# EAGLE design sh (EAGLE 9.6.2)
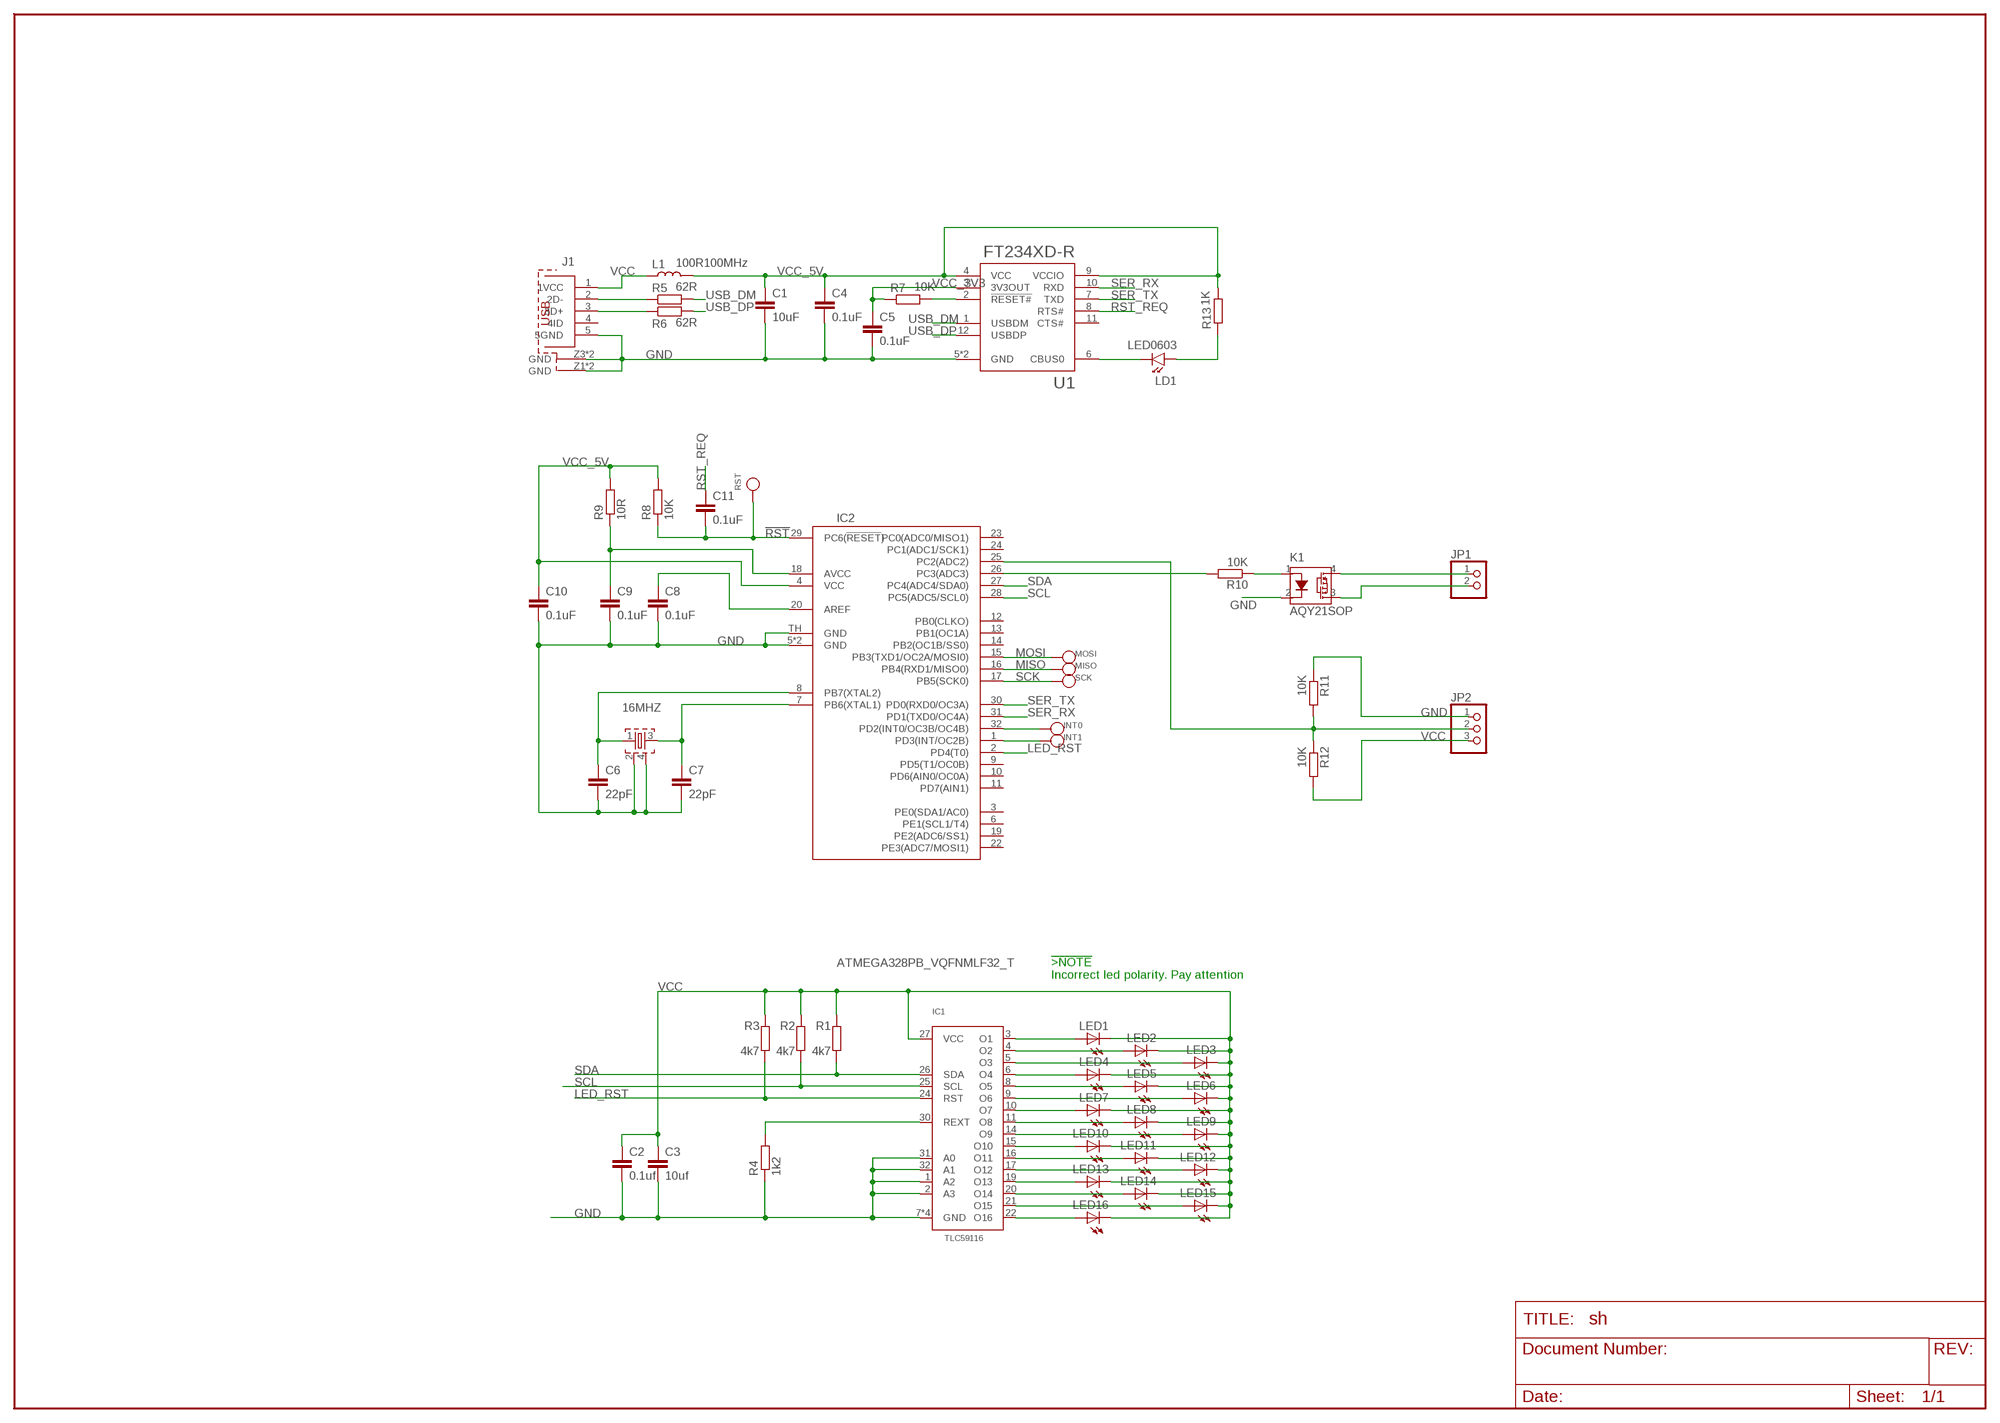
[diagram p0: schematic, sheet 1]

## Parts
16MHZ  QUARTZ_ZQ  [QUARTZ_3X3MM]
C1  10uF  SMD_C1206  [1206]
C2  0.1uf  SMD_C0603  [0603]
C3  10uf  SMD_C1206  [1206]
C4  0.1uF  SMD_C0603  [0603]
C5  0.1uF  SMD_C0603  [0603]
C6  22pF  SMD_C0603  [0603]
C7  22pF  SMD_C0603  [0603]
C8  0.1uF  SMD_C0603  [0603]
C9  0.1uF  SMD_C0603  [0603]
C10  0.1uF  SMD_C0603  [0603]
C11  0.1uF  SMD_C0603  [0603]
IC1  TLC59116  [MLF32-TH]
IC2  ATMEGA328PB_VQFNMLF32_T  [MLF32-TH]
INT0  TEST_POINT_D2MM  [TP]
INT1  TEST_POINT_D2MM  [TP]
J1  MINI_USB_TYP_B_@  [65100516121]
JP1  PINHD-1X2LIGHT  [2X01]
JP2  PINHD-1X3_LIGHT  [3X01]
K1  AQY21SOP  [SOP04]
L1  100R100MHz  SMD_L  [0805]
LD1  LED0603  [0603_P]
LED1  LED2KA-3528ASYC  [KA-3528ASYC]
LED2  LED2KA-3528ASYC  [KA-3528ASYC]
LED3  LED2KA-3528ASYC  [KA-3528ASYC]
LED4  LED2KA-3528ASYC  [KA-3528ASYC]
LED5  LED2KA-3528ASYC  [KA-3528ASYC]
LED6  LED2KA-3528ASYC  [KA-3528ASYC]
LED7  LED2KA-3528ASYC  [KA-3528ASYC]
LED8  LED2KA-3528ASYC  [KA-3528ASYC]
LED9  LED2KA-3528ASYC  [KA-3528ASYC]
LED10  LED2KA-3528ASYC  [KA-3528ASYC]
LED11  LED2KA-3528ASYC  [KA-3528ASYC]
LED12  LED2KA-3528ASYC  [KA-3528ASYC]
LED13  LED2KA-3528ASYC  [KA-3528ASYC]
LED14  LED2KA-3528ASYC  [KA-3528ASYC]
LED15  LED2KA-3528ASYC  [KA-3528ASYC]
LED16  LED2KA-3528ASYC  [KA-3528ASYC]
MISO  TEST_POINT_D2MM  [TP]
MOSI  TEST_POINT_D2MM  [TP]
R1  4k7  SMD_R0603  [0603]
R2  4k7  SMD_R0603  [0603]
R3  4k7  SMD_R0603  [0603]
R4  1k2  SMD_R0603  [0603]
R5  62R  SMD_R0603  [0603]
R6  62R  SMD_R0603  [0603]
R7  10K  SMD_R0603  [0603]
R8  10K  SMD_R0603  [0603]
R9  10R  SMD_R0603  [0603]
R10  10K  SMD_R0603  [0603]
R11  10K  SMD_R0603  [0603]
R12  10K  SMD_R0603  [0603]
R13  1K  SMD_R0603  [0603]
RST  TEST_POINT_D2MM  [TP]
SCK  TEST_POINT_D2MM  [TP]
U1  FT234XD-R  [IC_FT234XD-R]

## Nets
!RST: C11.2 IC2.29(PC6(!RESET!)) R8.1 RST.P$1
GND: 16MHZ.2 16MHZ.4 C1.2 C2.2 C3.2 C4.2 C5.2 C6.2 C7.2 C8.2 C9.2 C10.2 IC1.1(A2) IC1.2(A3) IC1.7(GND) IC1.18(GND) IC1.23(GND) IC1.31(A0) IC1.32(A1) IC1.TH(GND) IC2.5(GND) IC2.21(GND) IC2.TH(GND) J1.5(5GND) J1.Z1(GND) J1.Z2(GND) J1.Z3(GND) J1.Z4(GND) JP2.1 K1.2(K) R4.1 R11.1 U1.5(GND) U1.13(GND)
LED_RST: IC1.24(RST) IC2.2(PD4(T0)) R3.1
MISO: IC2.16(PB4(RXD1/MISO0)) MISO.P$1
MOSI: IC2.15(PB3(TXD1/OC2A/MOSI0)) MOSI.P$1
N$1: IC1.3(O1) LED1.A
N$2: IC1.4(O2) LED2.A
N$3: IC1.5(O3) LED3.A
N$4: IC1.6(O4) LED4.A
N$5: IC1.8(O5) LED5.A
N$6: IC1.9(O6) LED6.A
N$7: IC1.10(O7) LED7.A
N$8: IC1.11(O8) LED8.A
N$9: IC1.14(O9) LED9.A
N$10: IC1.15(O10) LED10.A
N$11: IC1.16(O11) LED11.A
N$12: IC1.17(O12) LED12.A
N$13: IC1.19(O13) LED13.A
N$14: IC1.20(O14) LED14.A
N$15: IC1.21(O15) LED15.A
N$16: IC1.22(O16) LED16.A
N$17: IC2.26(PC3(ADC3)) R10.2
N$18: 16MHZ.1 C6.1 IC2.8(PB7(XTAL2))
N$19: J1.2(2D-) R5.1
N$20: IC2.32(PD2(INT0/OC3B/OC4B)) INT0.P$1
N$21: J1.3(3D+) R6.1
N$22: IC1.30(REXT) R4.2
N$23: 16MHZ.3 C7.1 IC2.7(PB6(XTAL1))
N$24: R7.2 U1.2(!RESET#)
N$25: C8.1 IC2.20(AREF)
N$26: C9.1 IC2.18(AVCC) R9.1
N$27: JP1.1 K1.4(DS1)
N$29: K1.1(A) R10.1
N$30: JP1.2 K1.3(DS2)
N$31: LD1.1(K) U1.6(CBUS0)
N$32: LD1.2(A) R13.1
N$33: IC2.25(PC2(ADC2)) JP2.2 R11.2 R12.1
N$34: IC2.1(PD3(INT/OC2B)) INT1.P$1
RST_REQ: C11.1 U1.8(RTS#)
SCK: IC2.17(PB5(SCK0)) SCK.P$1
SCL: IC1.25(SCL) IC2.28(PC5(ADC5/SCL0)) R2.1
SDA: IC1.26(SDA) IC2.27(PC4(ADC4/SDA0)) R1.1
SER_RX: IC2.31(PD1(TXD0/OC4A)) U1.10(RXD)
SER_TX: IC2.30(PD0(RXD0/OC3A)) U1.7(TXD)
USB_DM: R5.2 U1.1(USBDM)
USB_DP: R6.2 U1.12(USBDP)
VCC: C2.1 C3.1 IC1.27(VCC) J1.1(1VCC) JP2.3 L1.1 LED1.C LED2.C LED3.C LED4.C LED5.C LED6.C LED7.C LED8.C LED9.C LED10.C LED11.C LED12.C LED13.C LED14.C LED15.C LED16.C R1.2 R2.2 R3.2 R12.2
VCC_3V3: C5.1 R7.1 U1.3(3V3OUT)
VCC_5V: C1.1 C4.1 C10.1 IC2.4(VCC) L1.2 R8.2 R9.2 R13.2 U1.4(VCC) U1.9(VCCIO)
Unconnected: IC2.3(PE0(SDA1/AC0)) IC2.6(PE1(SCL1/T4)) IC2.9(PD5(T1/OC0B)) IC2.10(PD6(AIN0/OC0A)) IC2.11(PD7(AIN1)) IC2.12(PB0(CLKO)) IC2.13(PB1(OC1A)) IC2.14(PB2(OC1B/SS0)) IC2.19(PE2(ADC6/SS1)) IC2.22(PE3(ADC7/MOSI1)) IC2.23(PC0(ADC0/MISO1)) IC2.24(PC1(ADC1/SCK1)) J1.4(4ID) U1.11(CTS#)

## Notes on the sheet
- !>NOTE
  Incorrect led polarity. Pay attention

## Library data of the parts
16MHZ = passive_components:QUARTZ_ZQ
C1-C11 = passive_components:SMD_C
IC1 = my_IC:TLC59116
IC2 = my_IC:ATMEGA328PB_VQFN
INT0 INT1 MISO MOSI RST SCK = passive_components:TEST_POINT_D2MM
J1 = passive_components:MINI_USB_TYP_B_@
JP1 = pinhead:PINHD-1X2: PIN HEADER
JP2 = pinhead:PINHD-1X3: PIN HEADER
K1 = relays:AQY*: PhotoMOS Relay NAiS Source: http://www.panasonic-electric-works.com/catalogues/downloads/photomos/ds_x615_en_aqz10_20.pdf; OC_FARNELL: unknown; OC_NEWARK: unknown
L1 = passive_components:SMD_L
LD1 = passive_components:LED
LED1-LED16 = rcl:LED2: LED OSRAM: - CHIPLED LG R971, LG N971, LY N971, LG Q971, LY Q971, LO R971, LY R971 LH N974, LH R974 LS Q976, LO Q976, LY Q976 LO Q996 - Hyper CHIPLED LW Q18S LB Q993, LB Q99A, LB R99A - SideLED LS A670, LO A670, LY A670, LG A670, LP A670 LB A673, LV A673, LT A673, LW A673 LH A674 LY A675 LS A676, LA A676, LO A676, LY A676, LW A676 LS A679, LY A679, LG A679 - Hyper Micro SIDELED® LS Y876, LA Y876, LO Y876, LY Y876 LT Y87S - SmartLED LW L88C, LW L88S LB L89C, LB L89S, LG L890 LS L89K, LO L89K, LY L89K LS L896, LA L896, LO L896, LY L896 - TOPLED LS T670, LO T670, LY T670, LG T670, LP T670 LSG T670, LSP T670, LSY T670, LOP T670, LYG T670 LG T671, LOG T671, LSG T671 LB T673, LV T673, LT T673, LW T673 LH T674 LS T676, LA T676, LO T676, LY T676, LB T676, LH T676, LSB T676, LW T676 LB T67C, LV T67C, LT T67C, LS T67K, LO T67K, LY T67K, LW E67C LS E67B, LA E67B, LO E67B, LY E67B, LB E67C, LV E67C, LT E67C LW T67C LS T679, LY T679, LG T679 LS T770, LO T770, LY T770, LG T770, LP T770 LB T773, LV T773, LT T773, LW T773 LH T774 LS E675, LA E675, LY E675, LS T675 LS T776, LA T776, LO T776, LY T776, LB T776 LHGB T686 LT T68C, LB T68C - Hyper Mini TOPLED® LB M676 - Mini TOPLED Santana® LG M470 LS M47K, LO M47K, LY M47K Source: http://www.osram.convergy.de LUXEON: - LUMILED® LXK2-PW12-R00, LXK2-PW12-S00, LXK2-PW14-U00, LXK2-PW14-V00 LXK2-PM12-R00, LXK2-PM12-S00, LXK2-PM14-U00 LXK2-PE12-Q00, LXK2-PE12-R00, LXK2-PE12-S00, LXK2-PE14-T00, LXK2-PE14-U00 LXK2-PB12-K00, LXK2-PB12-L00, LXK2-PB12-M00, LXK2-PB14-N00, LXK2-PB14-P00, LXK2-PB14-Q00 LXK2-PR12-L00, LXK2-PR12-M00, LXK2-PR14-Q00, LXK2-PR14-R00 LXK2-PD12-Q00, LXK2-PD12-R00, LXK2-PD12-S00 LXK2-PH12-R00, LXK2-PH12-S00 LXK2-PL12-P00, LXK2-PL12-Q00, LXK2-PL12-R00 Source: www.luxeon.com KINGBRIGHT: KA-3528ASYC Source: www.kingbright.com
R1-R13 = passive_components:SMD_R
U1 = my_IC:FT234XD-R: USB Bridge, USB to UART USB 2.0 UART Interface 12-DFN (3x3); AVAILABILITY: Unavailable; DESCRIPTION: USB Bridge, USB to UART USB 2.0 UART Interface 12-DFN (3x3); MF: FTDI,; MP: FT234XD-R; PACKAGE: DFN-12 FTDI; PRICE: None

## Board
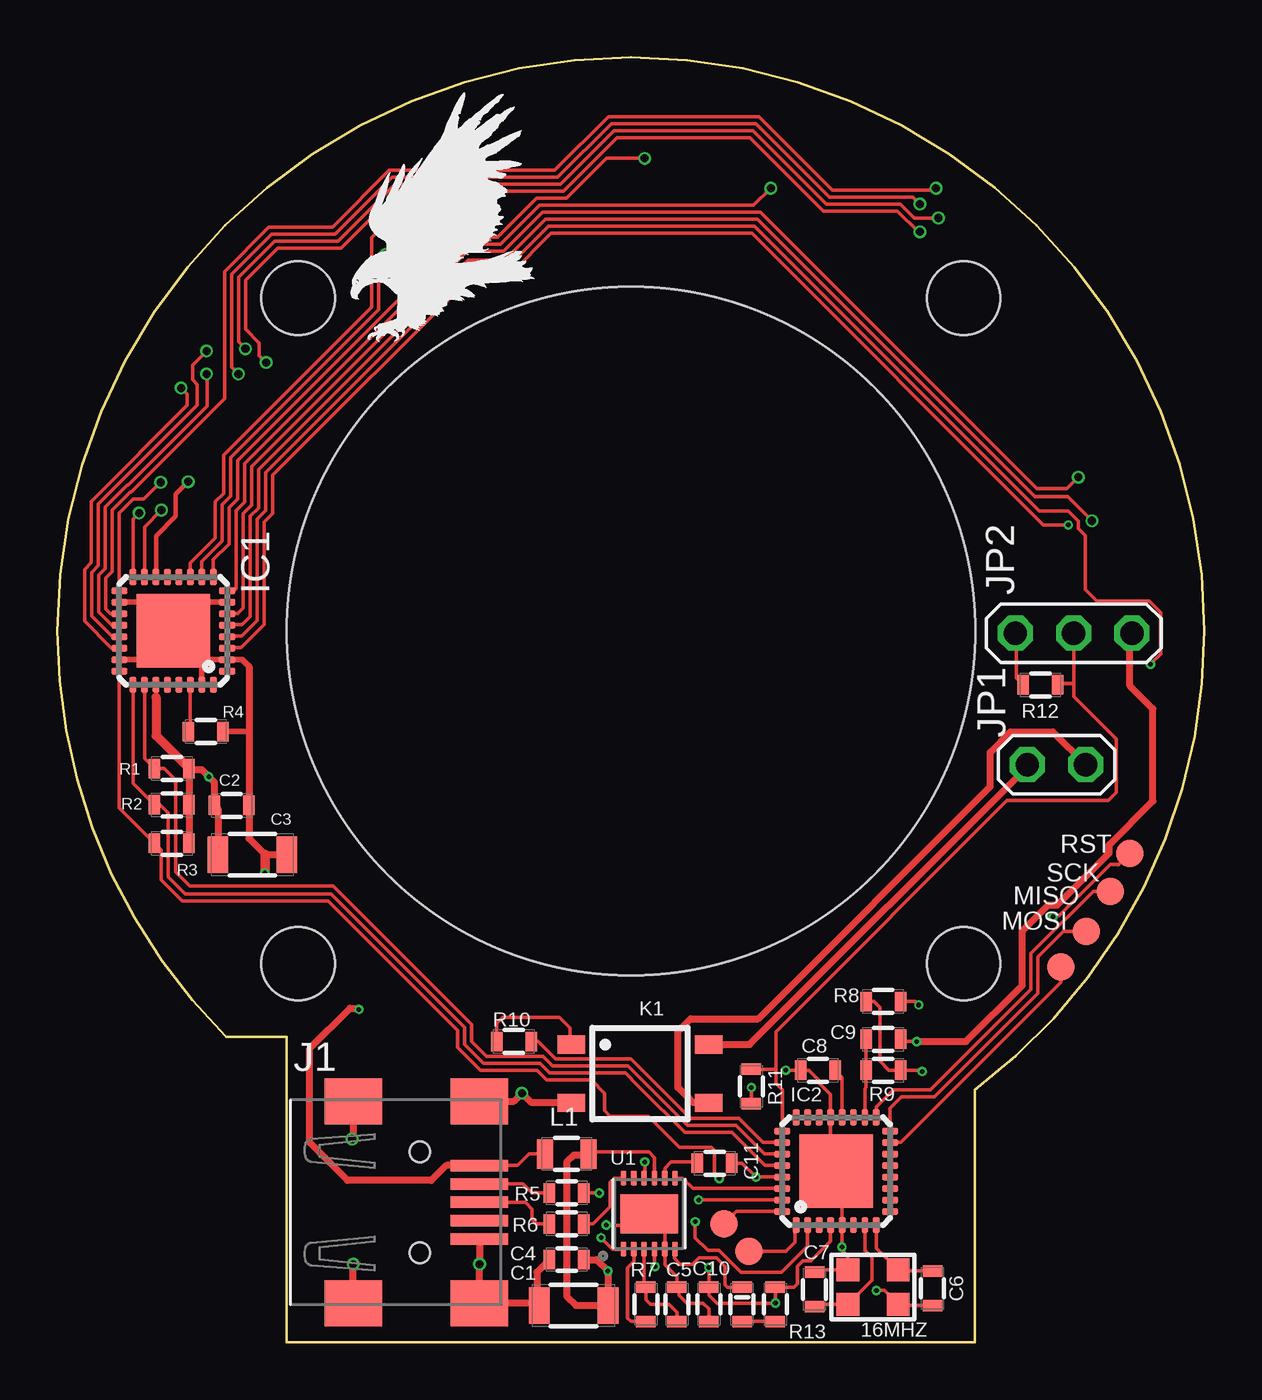
[diagram p1: board, top side]
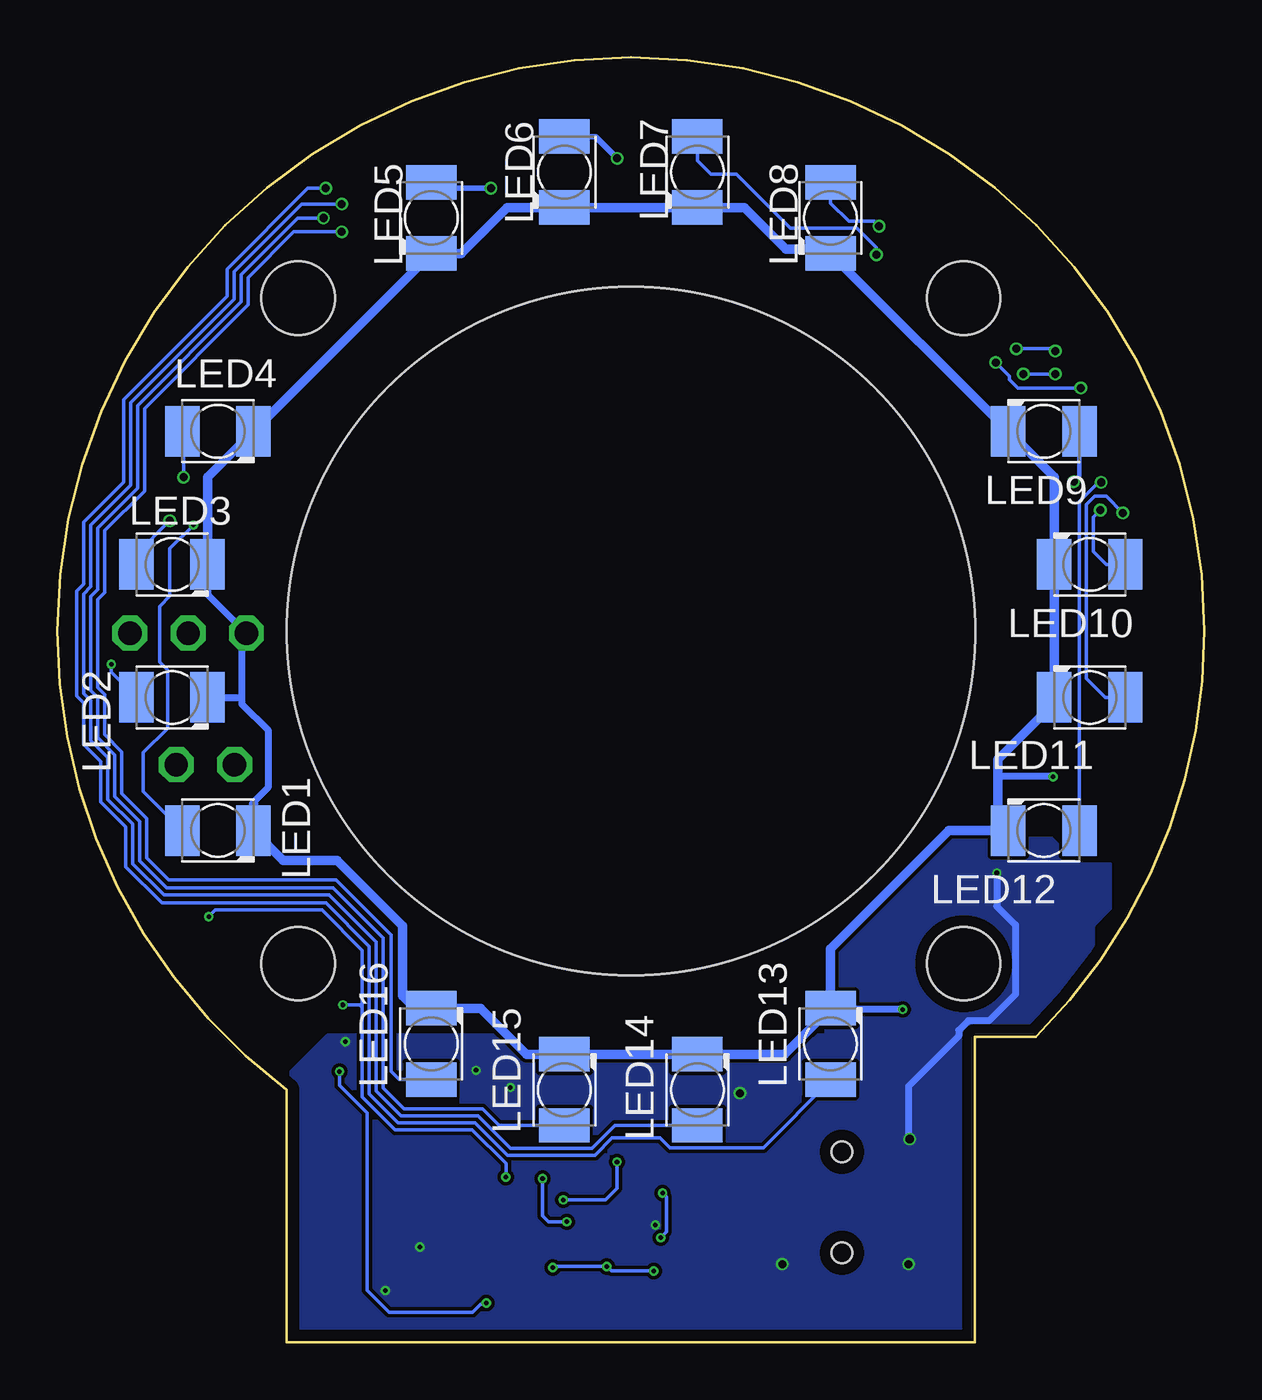
[diagram p2: board, bottom side, seen from below]

Size 50 x 56 mm. Coordinates in mm from the lower left corner, seen from the top.
Outline: 10,0 40,0 40,11 arc53 50,31 arc180 0,31 arc45 7.35,13.3 10,13.3 10,0
Copper layers (1*16): Top 0.035mm / dielectric 1.5mm / Bottom 0.035mm
Design rules "default *": minimum track width 6mil, minimum drill 0.2mm, track to track 6mil, track to pad 6mil, pad to pad 6mil, via to via 6mil, smd to smd 6mil, copper to edge 20mil, drill to drill 6mil, minimum pad ring 10mil, minimum via ring 4mil, stop-mask expansion 4mil, vias tented up to drill 20mil, thermal gap 10mil
Holes 3.2 mm at 10.5,45.5 39.5,45.5 39.5,16.5 10.5,16.5
Holes 30 mm at 25,31

### Footprints (pad centres in the part's own frame; a part is rotated, then mirrored left to right if it is on the bottom)
QUARTZ_3X3MM = smd 1 x 1: 1 -0.75,1.1; 2 0.75,1.1; 3 0.75,-1.1; 4 -0.75,-1.1
1206 = smd 1.6 x 0.9: 1 0,1.5; 2 0,-1.5
0603 = smd 0.85 x 0.5: 1 0,0.75; 2 0,-0.75
MLF32-TH = smd 0.7 x 0.3: 1 -2.35,1.75; 2 -2.35,1.25; 3 -2.35,0.75; 4 -2.35,0.25; 5 -2.35,-0.25; 6 -2.35,-0.75; 7 -2.35,-1.25; 8 -2.35,-1.75; 17 2.35,-1.75; 18 2.35,-1.25; 19 2.35,-0.75; 20 2.35,-0.25; 21 2.35,0.25; 22 2.35,0.75; 23 2.35,1.25; 24 2.35,1.75 | smd 0.3 x 0.7: 9 -1.75,-2.35; 10 -1.25,-2.35; 11 -0.75,-2.35; 12 -0.25,-2.35; 13 0.25,-2.35; 14 0.75,-2.35; 15 1.25,-2.35; 16 1.75,-2.35; 25 1.75,2.35; 26 1.25,2.35; 27 0.75,2.35; 28 0.25,2.35; 29 -0.25,2.35; 30 -0.75,2.35; 31 -1.25,2.35; 32 -1.75,2.35 | smd 3.2 x 3.2: TH 0,0
TP = smd 1.2 x 1.2: P$1 0,0
65100516121 = smd 0.5 x 2.5: 1 -1.6,2.6; 2 -0.8,2.6; 3 0,2.6; 4 0.8,2.6; 5 1.6,2.6 | smd 2 x 2.5: Z1 -4.4,2.6; Z2 4.4,2.6; Z3 4.4,-2.9; Z4 -4.4,-2.9 | hole 0.9: -2.2,0; 2.2,0
2X01 = drill 1.016 octagon: 1 -1.27,-1.27; 2 -1.27,1.27
3X01 = drill 1.016 octagon: 1 0,-2.54; 2 0,0; 3 0,2.54
SOP04 = smd 0.8 x 1.2: 1 -1.27,-3; 2 1.27,-3; 3 1.27,3; 4 -1.27,3
0805 = smd 1.3 x 0.7: 1 0,0.95; 2 0,-0.95
0603_P = smd 0.85 x 0.5: 1 0,0.75; 2 0,-0.75
KA-3528ASYC = smd 1.5 x 2.2: A -1.55,0; C 1.55,0
IC_FT234XD-R = smd 0.65 x 0.25: 1 -1.55,1.125; 2 -1.55,0.675; 3 -1.55,0.225; 4 -1.55,-0.225; 5 -1.55,-0.675; 6 -1.55,-1.125; 7 1.55,-1.125; 8 1.55,-0.675; 9 1.55,-0.225; 10 1.55,0.225; 11 1.55,0.675; 12 1.55,1.125 | smd 1.7 x 2.5: 13 0,0

### Placement (x,y rotation side)
16MHZ  35.55,2.4 270 top
C1  22.5,1.6 270 top
C2  7.6,23.4 90 top
C3  8.5,21.25 90 top
C4  22.2,3.6 270 top
C5  27,1.65 180 top
C6  38.15,2.35 0 top
C7  33,2.3 180 top
C8  33.15,11.85 270 top
C9  36,13.2 90 top
C10  28.4,1.65 0 top
C11  28.65,7.8 90 top
IC1  5.05,31 180 top
IC2  33.95,7.45 90 top
INT0  29.05,5.15 0 top
INT1  30.15,3.95 0 top
J1  15.8,6.1 270 top
JP1  43.55,23.9 270 top
JP2  44.3,30.9 90 top
K1  25.4,11.7 270 top
L1  22.2,8.2 90 top
LD1  29.85,1.65 0 top
LED1  43,22.3 0 bottom
LED2  45,28.1 0 bottom
LED3  45,33.9 0 bottom
LED4  43,39.7 0 bottom
LED5  33.7,49 270 bottom
LED6  27.9,51 270 bottom
LED7  22.1,51 270 bottom
LED8  16.3,49 270 bottom
LED9  7,39.7 180 bottom
LED10  5,33.9 180 bottom
LED11  5,28.1 180 bottom
LED12  7,22.3 180 bottom
LED13  16.3,13 90 bottom
LED14  22.1,11 90 bottom
LED15  27.9,11 90 bottom
LED16  33.7,13 90 bottom
MISO  44.85,17.9 0 top
MOSI  43.75,16.35 0 top
R1  4.99,25 90 top
R2  4.99,23.42 90 top
R3  4.99,21.74 90 top
R4  6.47,26.61 270 top
R5  22.2,6.5 90 top
R6  22.2,5.15 90 top
R7  25.65,1.65 0 top
R8  36,14.85 270 top
R9  36,11.85 90 top
R10  19.9,13.1 90 top
R11  30.25,11.15 180 top
R12  42.85,28.65 270 top
R13  31.3,1.65 180 top
RST  46.75,21.3 0 top
SCK  45.9,19.65 0 top
U1  25.8,5.6 90 top
U$1  [EAGLE-PLC-8MM]  12.8,43.6 0 top

### Tracks (layer width: path | path; a pad name or v marks a point on that pad's centre or on a via)
!RST  (via drill 0.2)
  Top 0.152: 46.25,20.8 46.27,20.82 | 46.27,20.82 RST.P$1 | IC2.29 v30.45,7.2 29.85,7.8 C11.2 | v43.4,18.55 43.4,18.6 43.67,18.6 45.89,20.82 46.27,20.82 | R8.1 37.4,14.85 v37.55,14.7
  Bottom 0.152: v30.45,7.2 30.45,7.79 31.92,9.26 35.27,9.26 36.71,10.7 36.71,14.6 | 36.71,14.6 36.71,17.08 38.46,18.83 43.12,18.83 v43.4,18.55 | v37.55,14.7 36.81,14.7 36.71,14.6
GND  (via drill 0.2, 0.35)
  Top 0.152: 5.05,30.95 IC1.TH | IC1.31 IC1.32 | IC1.1 IC1.2 | v23.93,5.1 25.3,5.1 U1.13 25.8,5.55 26.48,4.88 U1.5 26.48,3.48 26.48,3.37 27,2.85 C5.2 27,2.35 27.1,2.25 27.1,2.05 27.45,1.7 28.15,1.7 28.4,1.45 C10.2 | C7.2 33.1,3.15 16MHZ.4 34.45,3.75 34.2,4 v34.2,4.15 IC2.5 34.2,7.2 IC2.TH 33.7,7.7 IC2.21 33.7,10.8 33.2,11.3 33.2,11.4 32.75,11.85 C8.2 v31.75,11.85 | C6.2 36.7,1.6 16MHZ.2 36.05,2.25 v35.7,2.25 | C9.2 36.85,13.1 v37.45,13.1 | R11.1 v30.25,11.1
  Top 0.25: IC1.18 4,32.25 5.05,31.2 5.05,31.05 | 5.05,31.05 IC1.TH | IC1.7 6.4,32.25 6.35,32.3 6.3,32.3 5.1,31.1 | 5.1,31.1 5.05,31.05 | 5.05,30.95 3.85,29.75 IC1.23 | 6.3,29.75 IC1.2 8.05,29.75 8.35,29.45 | 6.3,29.75 5.85,29.75 5.1,30.5 5.1,31.1 | IC1.31 6.3,29.75 | R4.1 8.29,26.61 8.35,26.55
  Top 0.305: C3.2 9.05,21.25 8.35,21.95 C2.2 8.35,26.55 8.35,29.45 | J1.5 v18.4,3.4 J1.Z2 20.9,1.7 | 20.9,1.7 C1.2 | C4.2 20.9,3.05 20.9,1.7 | J1.Z4 12.9,8.9 v12.85,8.85 | J1.Z1 19.9,10.5 v20.25,10.85 20.67,10.43 K1.2 | J1.Z3 v12.9,3.4 | v37.45,13.1 39.61,13.1 42.05,15.54 42.05,17.92 43.19,19.06 43.59,19.06 45.84,21.32 45.84,21.68 47.75,23.58 47.75,27.6 46.75,28.6 46.75,30.81 JP2.1
  Top 0.406: 9.05,21.25 v9.05,20.45
  Bottom 0.152: v34.2,4.15 34.25,4.15
  Bottom 0.305: v12.85,8.85 12.9,8.9 12.9,11.15 10.71,13.34 10.71,13.6 10.29,14.01 9.39,14.01 8.24,15.16 8.24,18.19 9.05,19 v9.05,20.45
  pour Bottom: 10.15,13.3 38.2,13.3 39.8,11.7 39.8,0.2 10.2,0.2 10.2,13.25
  pour Bottom: 10.7,13.4 10.5,13.6 7.4,13.6 6.15,14.85 6.15,15.3 4.85,16.6 4.85,18.15 4.1,18.9 4.1,20.85 5.55,20.85 6.65,21.95 10.9,21.95 16.5,16.35 16.5,13.4
LED_RST  (via drill 0.2)
  Top 0.152: IC1.24 2.7,23.28 R3.1 4.53,21.45 4.53,20.15 5.45,19.23 11.81,19.23 17.44,13.6 17.44,12.85 18.45,11.84 20.92,11.84 21.33,11.43 23.27,11.43 23.85,10.85 23.85,10.1 24.1,9.85 25.77,9.85 27.12,8.49 | 27.12,8.49 27.13,8.48 | 27.12,8.49 28.5,8.49 28.65,8.35 28.65,7.3 28.82,7.13 v28.85,7.13 | IC2.2 32.7,4.18 31.55,3.04 29.95,3.04 29.85,3.04 29.8,3.04 28.83,4 28.35,4 27.8,4.55 v27.8,5.25
  Bottom 0.152: v28.85,7.13 28.85,5.5 28.6,5.25 v27.8,5.25
MISO
  Top 0.152: IC2.16 36.3,10.2 36.8,10.7 38.23,10.7 42.74,15.21 42.74,16.79 43.85,17.9 MISO.P$1
MOSI
  Top 0.152: IC2.15 36.76,8.7 43.75,15.69 MOSI.P$1
N$1  (via drill 0.2)
  Top 0.152: IC1.3 7.42,30.27 8,30.27 9.01,31.29 9.01,35.74 9.38,36.11 9.38,37.78 18.16,46.56 19.75,46.56 21.53,48.33 30.27,48.33 42.98,35.62 v44.07,35.62
  Bottom 0.152: LED1.A 46.25,24 46.25,25.7 45.2,26.75 45.2,29.3 45.55,29.65 45.55,32.07 45.09,32.52 45.09,34.59 v44.07,35.62
N$2  (via drill 0.2)
  Top 0.152: IC1.4 7.42,30.77 8.03,30.77 8.71,31.45 8.71,35.87 9.08,36.24 9.08,37.91 18.03,46.86 19.63,46.86 21.4,48.64 30.39,48.64 42.81,36.22 44.07,36.22 44.5,35.8 44.5,35.45 44.8,35.15 44.8,32.8 45.3,32.3 47.6,32.3 48.1,31.8 48.1,30 v47.65,29.55
  Bottom 0.152: v47.65,29.55 47.65,29.2 LED2.A
N$3  (via drill 0.35)
  Top 0.152: IC1.5 7.42,31.27 8.05,31.27 8.4,31.62 8.4,36 8.77,36.37 8.77,38.03 17.91,47.17 19.5,47.17 21.27,48.94 30.52,48.94 42.61,36.85 44.05,36.85 v45.1,35.8
  Bottom 0.152: v45.1,35.8 46.55,34.35 LED3.A
N$4  (via drill 0.35)
  Top 0.152: IC1.6 7.85,31.75 8.1,32 8.1,36.12 8.47,36.49 8.47,38.16 17.85,47.54 19.3,47.55 19.45,47.55 21.15,49.25 30.65,49.25 42.69,37.2 44,37.2 v44.5,37.7
  Bottom 0.152: v44.5,37.7 44.5,39.65 LED4.A
N$5  (via drill 0.35 pad 0.5)
  Top 0.152: IC1.8 7.7,32.75 7.79,32.84 7.79,36.25 8.16,36.62 8.16,38.3 17.72,47.85 19.32,47.85 21.02,49.55 30.35,49.55 v31.1,50.3
  Bottom 0.25: v31.1,50.3 33.45,50.3 LED5.A
N$6  (via drill 0.35 pad 0.5)
  Top 0.152: IC1.9 6.8,34.1 7.49,34.79 7.49,36.38 7.86,36.74 7.86,38.42 17.59,48.16 19.19,48.16 20.89,49.86 22.2,49.86 23.94,51.6 v25.6,51.6
  Bottom 0.25: v25.6,51.6 26.55,52.55 LED6.A
N$7  (via drill 0.35)
  Top 0.152: IC1.10 6.3,34.03 7.19,34.92 7.19,36.5 7.55,36.87 7.55,38.55 14,44.99 14,47.1 v14.3,47.4
  Bottom 0.152: LED7.A 22.1,51.5 21.5,50.9 20.4,50.9 18.05,48.55 15.15,48.55 14.3,47.7 v14.3,47.4
N$8  (via drill 0.35)
  Top 0.152: IC1.11 5.8,33.96 6.88,35.04 6.88,36.63 7.25,37 7.25,38.67 13.69,45.12 13.69,48.15 v14.18,48.64
  Bottom 0.152: LED8.A 16.3,49.65 15.51,48.85 14.4,48.85 v14.18,48.64
N$9  (via drill 0.35)
  Top 0.2: v5.7,37.5 5.17,36.97 5.17,36 4.3,35.13 IC1.14
  Bottom 0.2: v5.7,37.5 5.45,37.75 LED9.A
  Bottom 0.25: LED9.A 5.5,39.65
N$10  (via drill 0.35)
  Top 0.152: IC1.15 3.8,35.53 v4.54,36.26
  Bottom 0.152: v4.54,36.26 4.84,35.96 4.84,34.46 4.27,33.9 LED10.A
N$11  (via drill 0.35)
  Top 0.152: IC1.16 3.3,35.88 v3.56,36.14
  Bottom 0.152: v3.56,36.14 4.29,36.87 4.79,36.87 5.14,36.52 5.14,28.92 4.32,28.1 LED11.A
N$12  (via drill 0.35)
  Top 0.152: v4.5,37.48 3.77,36.75 3.31,36.75 2.7,36.14 IC1.17
  Bottom 0.152: v4.5,37.48 4.61,37.48 5.45,36.64 5.45,26.55 LED12.A
N$13  (via drill 0.35)
  Top 0.152: v38.3,50.3 38.21,50.21 33.78,50.21 30.58,53.41 24.02,53.41 21.68,51.08 14.47,51.08 11.99,48.6 9.22,48.6 7.29,46.67 7.29,41.12 3.22,37.05 3.18,37.05 2.4,36.27 2.4,33.59 2.1,33.3 2.1,31.95 2.3,31.75 IC1.19
  Bottom 0.152: LED13.A 16.3,11.4 19.23,8.47 23.3,8.47 23.72,8.9 25.82,8.9 26.57,8.14 30.38,8.14 31.79,9.56 35.15,9.56 36.41,10.82 36.41,17.26 38.29,19.14 45.43,19.14 47.01,20.72 47.01,22.45 48.1,23.54 48.1,25.3 48.85,26.05 48.85,27.85 49.16,28.16 49.16,32.74 48.85,33.05 48.85,35.74 47.11,37.48 47.11,41.08 42.6,45.59 42.6,46.78 39.08,50.3 v38.3,50.3
N$14  (via drill 0.35)
  Top 0.152: v37.6,49.61 37.3,49.91 33.65,49.91 30.45,53.11 24.15,53.11 21.81,50.77 14.59,50.77 12.12,48.29 9.34,48.29 7.59,46.54 7.59,42.5 v7.89,42.2 | IC1.20 2.68,31.27 2.35,31.27 1.79,31.82 1.79,33.43 2.09,33.72 2.09,36.4 3.05,37.36 3.09,37.36 6.53,40.8 6.53,42.17 v6.5,42.2
  Bottom 0.152: LED14.A 25.7,9.45 26.7,8.45 30.25,8.45 31.67,9.87 35.02,9.87 36.1,10.95 36.1,17.44 38.15,19.49 45.35,19.49 46.71,20.85 46.71,22.58 47.8,23.66 47.8,25.48 48.55,26.23 48.55,27.98 48.85,28.28 48.85,28.32 48.85,32.62 48.55,32.92 48.55,35.62 46.81,37.35 46.81,40.95 42.3,45.46 42.3,46.65 39.34,49.61 v37.6,49.61 | v7.89,42.2 v6.5,42.2
N$15  (via drill 0.35)
  Top 0.152: v38.4,49 37.35,49 36.74,49.6 33.53,49.6 30.33,52.8 24.27,52.8 21.93,50.47 14.72,50.47 12.24,47.99 9.47,47.99 7.89,46.41 7.89,43.6 v8.2,43.3 | IC1.21 2.65,30.8 2.34,30.8 1.49,31.65 1.49,33.55 1.79,33.85 1.79,36.52 6.1,40.84 6.1,41.74 5.89,41.95 5.89,42.59 v6.5,43.2
  Bottom 0.152: LED15.A 30.75,9.45 31.47,10.17 34.9,10.17 35.8,11.08 35.8,17.62 37.98,19.8 45.23,19.8 46.41,20.97 46.41,22.7 47.49,23.79 47.49,25.6 48.24,26.35 48.24,28.1 48.55,28.41 48.55,32.49 48.24,32.8 48.24,35.49 46.51,37.23 46.51,40.83 41.99,45.34 41.99,46.53 39.52,49 v38.4,49 | v6.5,43.2 6.6,43.3 v8.2,43.3
N$16  (via drill 0.35)
  Top 0.152: v37.6,48.39 37.52,48.39 36.62,49.3 33.4,49.3 30.2,52.5 24.4,52.5 22.06,50.16 14.85,50.16 12.37,47.68 9.6,47.68 8.2,46.29 8.2,44.16 8.8,43.55 8.8,43 v9.1,42.7 | IC1.22 2.68,30.27 2.33,30.27 1.19,31.42 1.19,33.68 1.48,33.97 1.48,36.65 5.67,40.83 5.67,41.32 v5.39,41.59
  Bottom 0.152: LED16.A 35.1,11.45 35.45,11.8 35.45,17.75 37.85,20.15 45.15,20.15 46.1,21.1 46.1,22.83 47.19,23.91 47.19,25.73 47.94,26.48 47.94,28.23 48.24,28.54 48.24,32.37 47.94,32.67 47.94,35.36 46.2,37.1 46.2,40.7 41.68,45.22 41.68,46.41 39.7,48.39 v37.6,48.39 | v5.39,41.59 8.14,41.59 8.5,41.95 8.5,42.1 v9.1,42.7
N$17
  Top 0.152: R10.2 20.95,13.1 21.7,12.34 25.01,12.34 27.6,9.75 29.7,9.75 30.75,8.7 IC2.26
N$18
  Top 0.152: C6.1 36.7,3.1 16MHZ.1 35.7,4.1 IC2.8
N$19
  Top 0.152: J1.2 20.3,6.9 20.7,6.5 R5.1
N$20
  Top 0.152: INT0.P$1 29.6,5.7 IC2.32
N$21
  Top 0.152: J1.3 20.4,6.1 20.7,5.8 20.7,5.35 20.9,5.15 R6.1
N$22
  Top 0.152: IC1.30 5.8,26.69 R4.2
N$23
  Top 0.152: IC2.7 35.2,4 35.5,3.7 35.5,2.7 16MHZ.3 33.1,1.65 C7.1
N$24
  Top 0.152: U1.2 25.12,3.52 24.85,3.25 24.85,1.05 25,0.9 R7.2
N$25
  Top 0.152: IC2.20 34.2,11.55 C8.1
N$26
  Top 0.152: C9.1 R9.1 35.25,11.1 35.2,11.05 IC2.18
N$27
  Top 0.305: K1.4 30.17,12.97 42.28,25.08 JP1.1
N$29
  Top 0.152: K1.1 22.35,13.02 22.35,13.7 21.9,14.15 19.4,14.15 19.15,13.9 R10.1
N$30
  Top 0.305: K1.3 27.72,10.43 27.05,11.1 27.05,13.55 27.6,14.1 30.55,14.1 40.66,24.21 40.66,25.71 41.55,26.6 43.39,26.6 JP1.2
N$31
  Top 0.152: U1.6 26.9,4.03 26.9,3.65 27.15,3.4 27.69,3.4 27.97,3.68 28.72,3.68 29.1,3.3 29.1,2.5 29.2,2.4 LD1.1
N$32
  Top 0.152: R13.1 LD1.2
N$33
  Top 0.152: IC2.25 31.6,11 31.32,11.28 31.32,11.9 | 31.32,11.9 31.32,13.53 41.39,23.6 45.8,23.6 46.15,23.95 46.15,26.3 44.3,28.15 44.3,28.7 | 44.3,28.7 JP2.2 | R11.2 31.32,11.9 | R12.1 43.65,28.7 44.3,28.7
N$34
  Top 0.152: IC2.1 32.15,5.05 32.15,4.35 31.75,3.95 INT1.P$1
RST_REQ
  Top 0.152: U1.8 26.48,7.58 26.75,7.85 27.85,7.85 C11.1
SCK
  Top 0.152: IC2.17 35.7,10.25 36.45,11 38.05,11 42.43,15.38 42.43,16.93 45.15,19.65 SCK.P$1
SCL
  Top 0.152: IC1.25 3.3,24.36 R2.1 | 4.84,20.28 5.58,19.53 11.94,19.53 17.75,13.72 17.75,12.97 18.58,12.14 21.04,12.14 21.45,11.73 24.76,11.73 25.29,11.2 25.42,11.07 27.35,9.14 29.41,9.14 30.85,7.7 IC2.28
  Top 0.16: R2.1 4.48,23.42 4.84,23.06 4.84,20.28
SDA
  Top 0.152: IC1.26 3.8,25.44 R1.1 | 5.15,20.51 5.77,19.88 12.02,19.88 18.05,13.85 18.05,13.1 18.7,12.45 21.17,12.45 21.58,12.04 24.88,12.04 27.47,9.45 29.57,9.45 30.82,8.2 IC2.27
  Top 0.16: R1.1 4.65,25 5.15,24.5 5.15,20.51
SER_RX  (via drill 0.2)
  Top 0.152: IC2.31 v27.95,6.2 | v25.6,7.85 25.6,7.18 U1.10
  Bottom 0.152: v27.95,6.2 26.1,6.2 25.6,6.7 v25.6,7.85
SER_TX
  Top 0.152: IC2.30 27.7,6.7 27.25,7.15 U1.7
USB_DM  (via drill 0.2)
  Top 0.152: R5.2 v23.62,6.5 | v23.7,4.55 24.2,4.05 U1.1
  Bottom 0.152: v23.62,6.5 23.45,6.33 23.45,4.8 v23.7,4.55
USB_DP
  Top 0.152: U1.12 24.27,7.15 24.1,6.97 24.1,5.9 23.35,5.15 R6.2
VCC  (via drill 0.2)
  Top 0.152: IC1.27 4.3,28.1 | 5.72,25.02 R1.2 | JP2.3 41.8,30.86 41.8,28.95 R12.2 | J1.1 20.05,7.7 20.55,8.2 L1.1
  Top 0.305: C3.1 7,23.25 C2.1 6.85,24.4 v6.6,24.65 6.3,24.95 5.79,24.95 R1.2 R2.2 R3.2 | J1.1 16.95,7.7 16.3,7.05 12.65,7.05 11,8.7 11,12.8 12.75,14.55 13.1,14.55 v13.15,14.5
  Top 0.4: 4.3,28.1 4.3,26.44 5.72,25.02
  Bottom 0.305: v6.6,24.65 9,24.65 | LED3.C 43.45,32.59 JP2.3 41.95,30.71 41.95,28.1 | LED1.C 41.45,23.55 40.8,24.2 40.8,26.65 41.95,27.8 41.95,28.1 | LED2.C 41.95,28.1 | v13.15,14.5 16.25,14.5 LED13.C
  Bottom 0.406: 41.45,23.45 LED1.C 40.15,21 37.8,21 34.95,18.15 34.95,15.1 34.4,14.55 LED16.C 31.55,14.55 29.55,12.55 LED15.C LED14.C 18.3,12.55 LED13.C 16.3,17.15 11.15,22.3 LED12.C 9,22.75 9,24.65 9,25.4 6.55,27.85 LED11.C LED10.C 6.55,37.7 LED9.C LED8.C 16.5,47.65 18.25,47.65 20.05,49.45 LED7.C LED6.C 30.4,49.45 32.4,47.45 LED5.C LED4.C 43.45,37.7 LED3.C
VCC_3V3
  Top 0.152: U1.3 25.57,2.48 R7.1 25.65,1.85 25.85,1.65 26.65,1.65 27,1.3 C5.1
VCC_5V  (via drill 0.2)
  Top 0.152: U1.4 26.02,3.33 v26.05,3.3 | IC2.4 33.7,4.4 32.85,3.55 32.5,3.55 32.25,3.3 32.25,2.55 32.1,2.4 R13.2 v31.3,1.7 28.75,1.7 28.4,2.05 C10.1 v28.4,3.25 | v37.7,11.8 37.65,11.85 R9.2 36.25,11.85 35.85,12.25 35.85,14.6 35.6,14.85 R8.2 | U1.9 26.02,7.67 26.03,7.68 26.03,8.03 25.78,8.28 23.23,8.28 L1.2
  Top 0.305: C4.1 23.5,3.6 v24,3.1 C1.1 22.6,1.6 22.2,2 22.2,7.85 22.5,8.15 23.1,8.15 L1.2
  Bottom 0.152: v24,3.1 25.85,3.1 v26.05,3.3 28.35,3.3 v28.4,3.25 | v37.7,11.8 37.7,11.2 36.5,10 36.5,2.25 35.55,1.3 31.9,1.3 31.55,1.65 31.35,1.65 v31.3,1.7